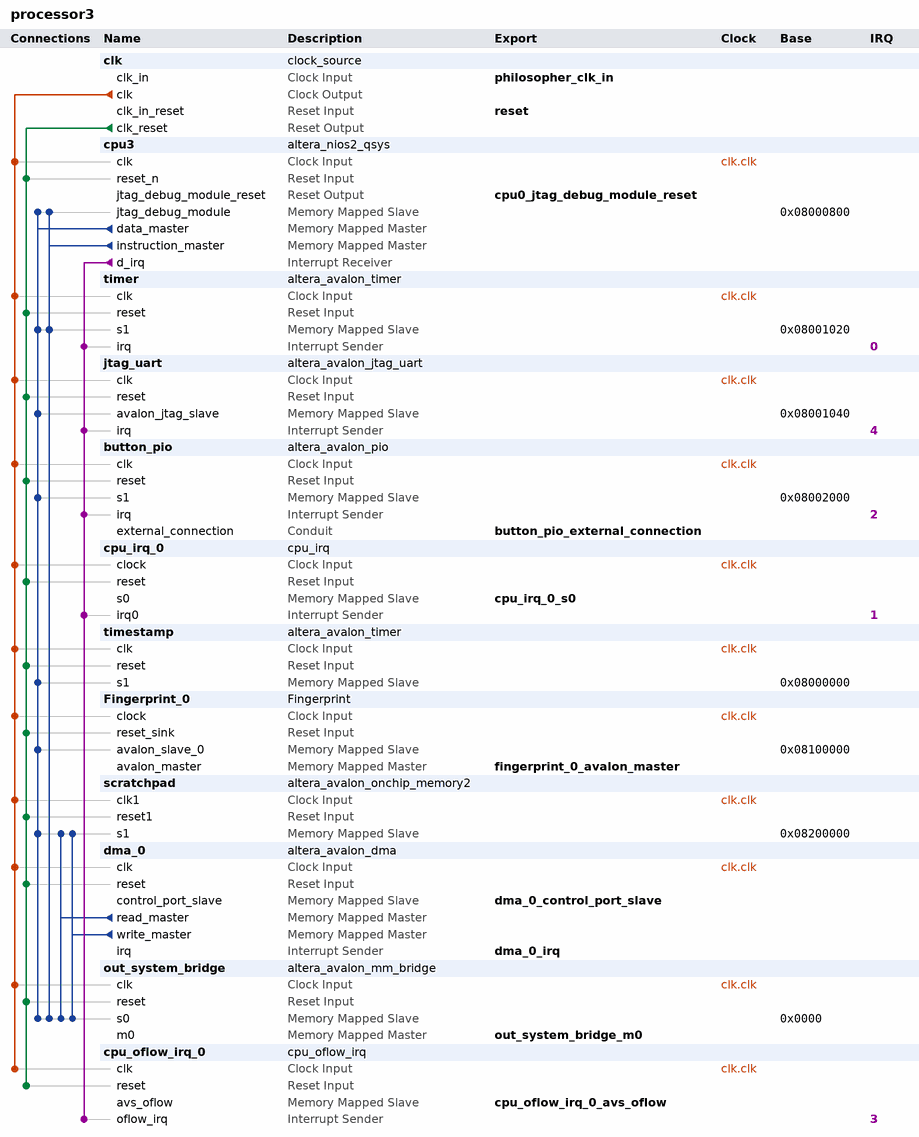
[diagram p0: system contents]
# Platform Designer (Qsys) system processor3, Arria V 5AGXFB3H4F35C5
# Parameters at their usual value, and those the tool derives, are not listed.
package require -exact qsys 13.1
create_system processor3
set_project_property DEVICE_FAMILY {Arria V}
set_project_property DEVICE 5AGXFB3H4F35C5

add_instance clk clock_source 13.1
set_instance_parameter_value clk clockFrequency 50000000

add_instance cpu3 altera_nios2_qsys 13.1
set_instance_parameter_value cpu3 mpu_enabled true
set_instance_parameter_value cpu3 mpu_numOfDataRegion 16
set_instance_parameter_value cpu3 resetOffset 4587520
set_instance_parameter_value cpu3 exceptionOffset 4587552
set_instance_parameter_value cpu3 cpuID 4
set_instance_parameter_value cpu3 resetSlave Absolute
set_instance_parameter_value cpu3 exceptionSlave Absolute
set_instance_parameter_value cpu3 breakSlave cpu3.jtag_debug_module
set_instance_parameter_value cpu3 muldiv_multiplierType NoneSmall
set_instance_parameter_value cpu3 mpu_minDataRegionSize 10
set_instance_parameter_value cpu3 impl Fast
set_instance_parameter_value cpu3 icache_size 1024
set_instance_parameter_value cpu3 dcache_size 0

add_instance timer altera_avalon_timer 13.1
set_instance_parameter_value timer period 10
set_instance_parameter_value timer periodUnits MSEC

add_instance jtag_uart altera_avalon_jtag_uart 13.1
set_instance_parameter_value jtag_uart simInteractiveOptions INTERACTIVE_ASCII_OUTPUT

add_instance button_pio altera_avalon_pio 13.1
set_instance_parameter_value button_pio bitClearingEdgeCapReg true
set_instance_parameter_value button_pio captureEdge true
set_instance_parameter_value button_pio direction Input
set_instance_parameter_value button_pio generateIRQ true
set_instance_parameter_value button_pio irqType EDGE
set_instance_parameter_value button_pio width 1

add_instance cpu_irq_0 cpu_irq 1.0

add_instance timestamp altera_avalon_timer 13.1
set_instance_parameter_value timestamp counterSize 64
set_instance_parameter_value timestamp period 1
set_instance_parameter_value timestamp periodUnits MSEC

add_instance Fingerprint_0 Fingerprint 1.0
set_instance_parameter_value Fingerprint_0 CORE_ID 3

add_instance scratchpad altera_avalon_onchip_memory2 13.1
set_instance_parameter_value scratchpad dataWidth 32
set_instance_parameter_value scratchpad dualPort false
set_instance_parameter_value scratchpad initMemContent true
set_instance_parameter_value scratchpad initializationFileName onchip_mem.hex
set_instance_parameter_value scratchpad memorySize 16384

add_instance dma_0 altera_avalon_dma 13.1
set_instance_parameter_value dma_0 allowByteTransactions true
set_instance_parameter_value dma_0 allowDoubleWordTransactions true
set_instance_parameter_value dma_0 allowHalfWordTransactions true
set_instance_parameter_value dma_0 allowQuadWordTransactions true
set_instance_parameter_value dma_0 burstEnable false
set_instance_parameter_value dma_0 fifoDepth 32
set_instance_parameter_value dma_0 maxBurstSize 128
set_instance_parameter_value dma_0 minimumDmaTransactionRegisterWidth 13

add_instance out_system_bridge altera_avalon_mm_bridge 13.1
set_instance_parameter_value out_system_bridge DATA_WIDTH 32
set_instance_parameter_value out_system_bridge ADDRESS_WIDTH 27
set_instance_parameter_value out_system_bridge ADDRESS_UNITS SYMBOLS
set_instance_parameter_value out_system_bridge MAX_PENDING_RESPONSES 4

add_instance cpu_oflow_irq_0 cpu_oflow_irq 1.0

# connections
add_connection clk.clk button_pio.clk clock
add_connection clk.clk cpu3.clk clock
add_connection clk.clk cpu_irq_0.clock clock
add_connection clk.clk cpu_oflow_irq_0.clk clock
add_connection clk.clk dma_0.clk clock
add_connection clk.clk Fingerprint_0.clock clock
add_connection clk.clk jtag_uart.clk clock
add_connection clk.clk out_system_bridge.clk clock
add_connection clk.clk scratchpad.clk1 clock
add_connection clk.clk timer.clk clock
add_connection clk.clk timestamp.clk clock
add_connection clk.clk_reset button_pio.reset reset
add_connection clk.clk_reset cpu3.reset_n reset
add_connection clk.clk_reset cpu_irq_0.reset reset
add_connection clk.clk_reset cpu_oflow_irq_0.reset reset
add_connection clk.clk_reset dma_0.reset reset
add_connection clk.clk_reset Fingerprint_0.reset_sink reset
add_connection clk.clk_reset jtag_uart.reset reset
add_connection clk.clk_reset out_system_bridge.reset reset
add_connection clk.clk_reset scratchpad.reset1 reset
add_connection clk.clk_reset timer.reset reset
add_connection clk.clk_reset timestamp.reset reset
add_connection cpu3.data_master button_pio.s1 avalon
set_connection_parameter_value cpu3.data_master/button_pio.s1 baseAddress 0x08002000
add_connection cpu3.data_master cpu3.jtag_debug_module avalon
set_connection_parameter_value cpu3.data_master/cpu3.jtag_debug_module baseAddress 0x08000800
add_connection cpu3.data_master Fingerprint_0.avalon_slave_0 avalon
set_connection_parameter_value cpu3.data_master/Fingerprint_0.avalon_slave_0 baseAddress 0x08100000
add_connection cpu3.data_master jtag_uart.avalon_jtag_slave avalon
set_connection_parameter_value cpu3.data_master/jtag_uart.avalon_jtag_slave baseAddress 0x08001040
add_connection cpu3.data_master out_system_bridge.s0 avalon
set_connection_parameter_value cpu3.data_master/out_system_bridge.s0 baseAddress 0x0000
add_connection cpu3.data_master scratchpad.s1 avalon
set_connection_parameter_value cpu3.data_master/scratchpad.s1 baseAddress 0x08200000
add_connection cpu3.data_master timer.s1 avalon
set_connection_parameter_value cpu3.data_master/timer.s1 baseAddress 0x08001020
add_connection cpu3.data_master timestamp.s1 avalon
set_connection_parameter_value cpu3.data_master/timestamp.s1 baseAddress 0x08000000
add_connection cpu3.instruction_master cpu3.jtag_debug_module avalon
set_connection_parameter_value cpu3.instruction_master/cpu3.jtag_debug_module baseAddress 0x08000800
add_connection cpu3.instruction_master out_system_bridge.s0 avalon
set_connection_parameter_value cpu3.instruction_master/out_system_bridge.s0 baseAddress 0x0000
add_connection cpu3.instruction_master timer.s1 avalon
set_connection_parameter_value cpu3.instruction_master/timer.s1 baseAddress 0x08001020
add_connection dma_0.read_master out_system_bridge.s0 avalon
set_connection_parameter_value dma_0.read_master/out_system_bridge.s0 baseAddress 0x0000
add_connection dma_0.read_master scratchpad.s1 avalon
set_connection_parameter_value dma_0.read_master/scratchpad.s1 baseAddress 0x08200000
add_connection dma_0.write_master out_system_bridge.s0 avalon
set_connection_parameter_value dma_0.write_master/out_system_bridge.s0 baseAddress 0x0000
add_connection dma_0.write_master scratchpad.s1 avalon
set_connection_parameter_value dma_0.write_master/scratchpad.s1 baseAddress 0x08200000
add_connection cpu3.d_irq button_pio.irq interrupt
set_connection_parameter_value cpu3.d_irq/button_pio.irq irqNumber 2
add_connection cpu3.d_irq cpu_irq_0.irq0 interrupt
set_connection_parameter_value cpu3.d_irq/cpu_irq_0.irq0 irqNumber 1
add_connection cpu3.d_irq cpu_oflow_irq_0.oflow_irq interrupt
set_connection_parameter_value cpu3.d_irq/cpu_oflow_irq_0.oflow_irq irqNumber 3
add_connection cpu3.d_irq jtag_uart.irq interrupt
set_connection_parameter_value cpu3.d_irq/jtag_uart.irq irqNumber 4
add_connection cpu3.d_irq timer.irq interrupt
set_connection_parameter_value cpu3.d_irq/timer.irq irqNumber 0

# exported interfaces
add_interface philosopher_clk_in clock sink
set_interface_property philosopher_clk_in EXPORT_OF clk.clk_in
add_interface button_pio_external_connection conduit end
set_interface_property button_pio_external_connection EXPORT_OF button_pio.external_connection
add_interface cpu0_jtag_debug_module_reset reset source
set_interface_property cpu0_jtag_debug_module_reset EXPORT_OF cpu3.jtag_debug_module_reset
add_interface reset reset sink
set_interface_property reset EXPORT_OF clk.clk_in_reset
add_interface cpu_irq_0_s0 avalon slave
set_interface_property cpu_irq_0_s0 EXPORT_OF cpu_irq_0.s0
add_interface fingerprint_0_avalon_master avalon master
set_interface_property fingerprint_0_avalon_master EXPORT_OF Fingerprint_0.avalon_master
add_interface dma_0_control_port_slave avalon slave
set_interface_property dma_0_control_port_slave EXPORT_OF dma_0.control_port_slave
add_interface dma_0_irq interrupt sender
set_interface_property dma_0_irq EXPORT_OF dma_0.irq
add_interface out_system_bridge_m0 avalon master
set_interface_property out_system_bridge_m0 EXPORT_OF out_system_bridge.m0
add_interface cpu_oflow_irq_0_avs_oflow avalon slave
set_interface_property cpu_oflow_irq_0_avs_oflow EXPORT_OF cpu_oflow_irq_0.avs_oflow

set_interconnect_requirement {$system} qsys_mm.clockCrossingAdapter HANDSHAKE
set_interconnect_requirement {$system} qsys_mm.maxAdditionalLatency 1

save_system processor3.qsys
